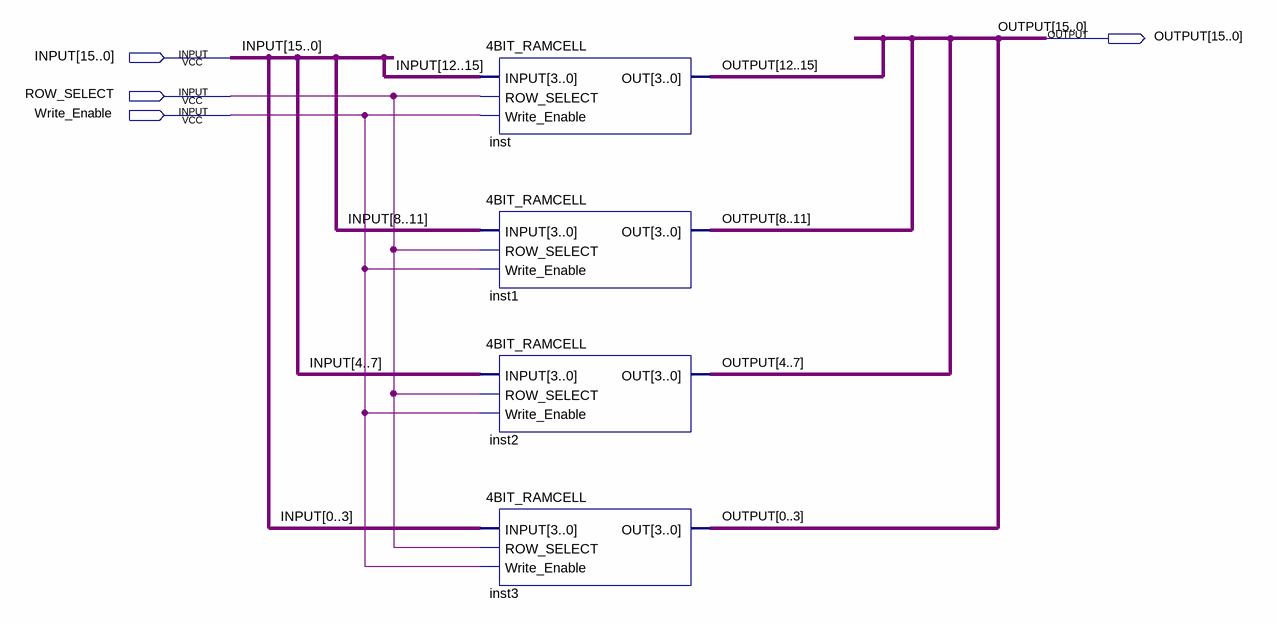
[diagram p0: schematic sheet]
// Quartus schematic 16BIT_RAMCELL.bdf as structural Verilog: 4 symbols, 4 pins
module \16BIT_RAMCELL  (
  input  [15:0] INPUT,
  input  ROW_SELECT,
  input  Write_Enable,
  output [15:0] OUTPUT
);

  \4BIT_RAMCELL  inst (
    .INPUT({INPUT[12], INPUT[13], INPUT[14], INPUT[15]}), .ROW_SELECT(ROW_SELECT),
    .Write_Enable(Write_Enable), .OUT({OUTPUT[12], OUTPUT[13], OUTPUT[14], OUTPUT[15]}));
  \4BIT_RAMCELL  inst1 (
    .INPUT({INPUT[8], INPUT[9], INPUT[10], INPUT[11]}), .ROW_SELECT(ROW_SELECT), .Write_Enable(Write_Enable),
    .OUT({OUTPUT[8], OUTPUT[9], OUTPUT[10], OUTPUT[11]}));
  \4BIT_RAMCELL  inst2 (
    .INPUT({INPUT[4], INPUT[5], INPUT[6], INPUT[7]}), .ROW_SELECT(ROW_SELECT), .Write_Enable(Write_Enable),
    .OUT({OUTPUT[4], OUTPUT[5], OUTPUT[6], OUTPUT[7]}));
  \4BIT_RAMCELL  inst3 (
    .INPUT({INPUT[0], INPUT[1], INPUT[2], INPUT[3]}), .ROW_SELECT(ROW_SELECT), .Write_Enable(Write_Enable),
    .OUT({OUTPUT[0], OUTPUT[1], OUTPUT[2], OUTPUT[3]}));
endmodule
